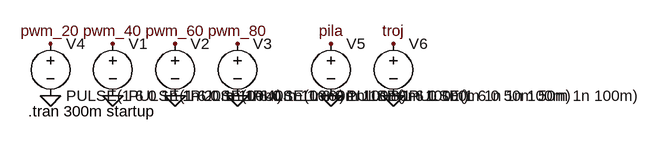
[diagram p0: schematic zad1.asc]
zad1.asc, the LTspice schematic file:
Version 4
SHEET 1 880 1620
FLAG -1456 1040 0
FLAG -1456 960 pwm_80
FLAG -1552 1040 0
FLAG -1552 960 pwm_60
FLAG -1648 1040 0
FLAG -1648 960 pwm_40
FLAG -1744 1040 0
FLAG -1744 960 pwm_20
FLAG -1216 1040 0
FLAG -1216 960 troj
FLAG -1312 1040 0
FLAG -1312 960 pila
SYMBOL voltage -1744 944 R0
WINDOW 123 0 0 Left 0
WINDOW 39 0 0 Left 0
SYMATTR InstName V4
SYMATTR Value PULSE(1 6 0 1n 1n 20m 100m)
SYMBOL voltage -1648 944 R0
WINDOW 123 0 0 Left 0
WINDOW 39 0 0 Left 0
SYMATTR InstName V1
SYMATTR Value PULSE(1 6 0 1n 1n 40m 100m)
SYMBOL voltage -1552 944 R0
WINDOW 123 0 0 Left 0
WINDOW 39 0 0 Left 0
SYMATTR InstName V2
SYMATTR Value PULSE(1 6 0 1n 1n 60m 100m)
SYMBOL voltage -1456 944 R0
WINDOW 123 0 0 Left 0
WINDOW 39 0 0 Left 0
SYMATTR InstName V3
SYMATTR Value PULSE(1 6 0 1n 1n 80m 100m)
SYMBOL voltage -1312 944 R0
WINDOW 123 0 0 Left 0
WINDOW 39 0 0 Left 0
SYMATTR InstName V5
SYMATTR Value PULSE(1 6 0 100m 1n 1n 100m)
SYMBOL voltage -1216 944 R0
WINDOW 123 0 0 Left 0
WINDOW 39 0 0 Left 0
SYMATTR InstName V6
SYMATTR Value PULSE(1 6 0 50m 50m 1n 100m)
TEXT -1778 1064 Left 2 !.tran 300m startup

The netlist it stands for:
* zad1.asc
V4 pwm_20 0 PULSE(1 6 0 1n 1n 20m 100m)
V1 pwm_40 0 PULSE(1 6 0 1n 1n 40m 100m)
V2 pwm_60 0 PULSE(1 6 0 1n 1n 60m 100m)
V3 pwm_80 0 PULSE(1 6 0 1n 1n 80m 100m)
V5 pila 0 PULSE(1 6 0 100m 1n 1n 100m)
V6 troj 0 PULSE(1 6 0 50m 50m 1n 100m)
.tran 300m startup
.backanno
.end